# Altium schematic sheet Reset.SchDoc
size A; SheetNumber: 11; SheetTotal: 12
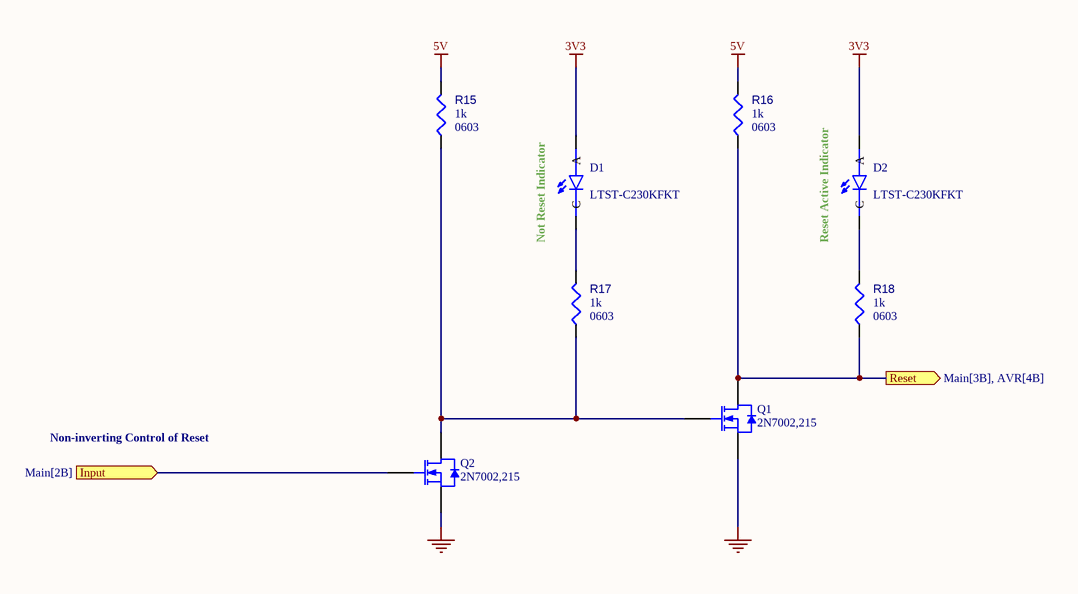
[diagram p0: Reset.SchDoc]

## Parts
D1  LTST-C230KFKT  [LEDC3216X110]
D2  LTST-C230KFKT  [LEDC3216X110]
Q1  2N7002,215  [NXP-SOT23-3_V]
Q2  2N7002,215  [NXP-SOT23-3_V]
R15  value 1k  Case/Package: 0603  [RESC1608X55X25ML10T15]  (hidden comment: Resistor 1k +/-1% 0603 100 mW)
R16  value 1k  Case/Package: 0603  [RESC1608X55X25ML10T15]  (hidden comment: Resistor 1k +/-1% 0603 100 mW)
R17  value 1k  Case/Package: 0603  [RESC1608X55X25ML10T15]  (hidden comment: Resistor 1k +/-1% 0603 100 mW)
R18  value 1k  Case/Package: 0603  [RESC1608X55X25ML10T15]  (hidden comment: Resistor 1k +/-1% 0603 100 mW)

## Ports
Input (in, see Main[2B]), Reset (out, see Main[3B], AVR[4B])

## Nets
3V3: D1.A D2.A
5V: R15.2 R16.2
GND: Q1.2(S) Q2.2(S)
Input: Q2.1(G) ; port Input
Reset: Q1.3(D) R16.1 R18.1 ; port Reset
NetD1_C: D1.C R17.2
NetD2_C: D2.C R18.2
NetQ1_1: Q1.1(G) Q2.3(D) R15.1 R17.1

## Notes on the sheet
- (near D1) Not Reset Indicator
- (near D2) Reset Active Indicator
- Non-inverting Control of Reset

## Library data of the parts
D1 D2 = CMP-010-000000-1: Orange 605nm LED Indication - Discrete 2V 1206 (3216 Metric); MF: Lite-On Inc.; Package: 1206 Lite-On; MP: LTST-C230KFKT; Pin Count: 2; Component Type: Standard; Source: LTST-C230KFKT.SchLib; Value: *; SnapEDA_Link: https://www.snapeda.com/parts/LTST-C230KFKT/Lite-On%20Inc./view-part/353318/?ref=snap; Price: None; Availability: Unavailable; Design Item ID: LTST-C230KFKT
Q1 Q2 = CMP-013-00011-4: N-channel Trench MOSFET, 60 V, 300 mA, -65 to 150 degC, 3-Pin SOT-23 (TO-236AB), RoHS, Tape and Reel; Manufacturer: NXP Semiconductors; Elements: 1; Power: 830mW; Max Dual Supply Voltage: 60V; Rds On Max: 5Ohm; Package Version: Feb-16; Nominal Vgs: 2V; Input Capacitance: 50pF; RoHS Compliant: True; Datasheet URL: http://www.nxp.com/documents/data_sheet/2N7002.pdf; Packaging: TapeandReel; Case/Package: TO-236-3; Package Reference: SOT23-3; Max Operating Temperature: 150°C; Pins: 8; Mounting Technology: SM; Package Quantity: 1; Datasheet Version: Rev. 7, 09/2011; Nominal Dual Supply Voltage: 60V; Min Operating Temperature: -65°C; Package Description: 3-Pin Small Outline Transistor, Body 1.3 x 2.9 mm, Pitch 0.95 mm; Vds Max: 60V
R15-R18 = CMP-009-00014-5: Chip Resistor, 1 KOhm, +/-1%, 0.1 W, -55 to 155 degC, 0603 (1608 Metric); Voltage Rating: 50V; Power: 100mW; Tolerance: 1%; Mounting Technology: SM; Pins: 2; Min Operating Temperature: -55°C; RoHS Compliant: True; Max Operating Temperature: 155°C